# Altium schematic sheet CW342_XADC.SchDoc: <Enter Sheet Title>
size Letter; Organization: NewAE Technology Inc.; Address1: 1083 Queen St., Suite 196; Address2: Halifax; Address3: NS; Address4: Canada B3H 0B2; SheetNumber: 2; SheetTotal: 9; SheetApproved: NO
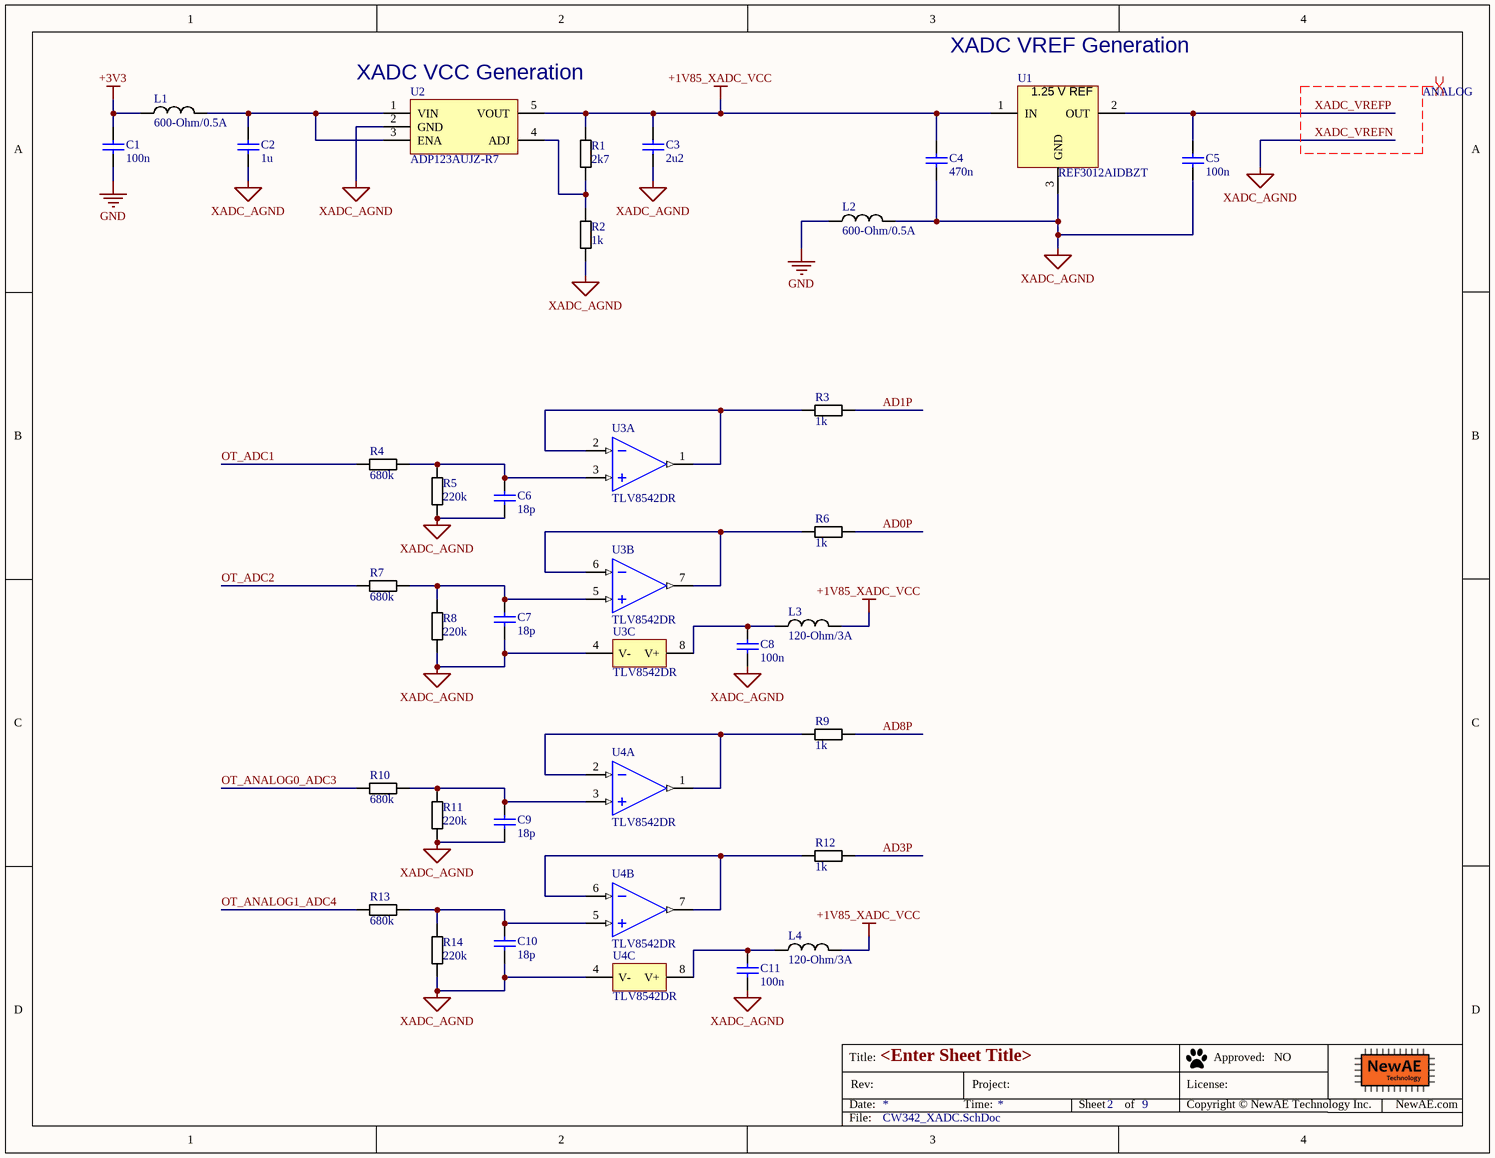
[diagram p0: CW342_XADC.SchDoc]

## Parts
C1  100n  [CAPC0402_M]
C2  1u  [CAPC0603_M]
C3  2u2  [CAPC0603_M]
C4  470n  [CAPC0603_M]
C5  100n  [CAPC0402_M]
C6  18p  [CAPC0402_M]
C7  18p  [CAPC0402_M]
C8  100n  [CAPC0402_M]
C9  18p  [CAPC0402_M]
C10  18p  [CAPC0402_M]
C11  100n  [CAPC0402_M]
L1  600-Ohm/0.5A  [IND_0603]
L2  600-Ohm/0.5A  [IND_0603]
L3  120-Ohm/3A  [IND_0603]
L4  120-Ohm/3A  [IND_0603]
R1  2k7  [RESC1005X40N]
R2  1k  [RESC1005X40N]
R3  1k  [RESC1005X40N]
R4  680k  [RESC1005X40N]
R5  220k  [RESC1005X40N]
R6  1k  [RESC1005X40N]
R7  680k  [RESC1005X40N]
R8  220k  [RESC1005X40N]
R9  1k  [RESC1005X40N]
R10  680k  [RESC1005X40N]
R11  220k  [RESC1005X40N]
R12  1k  [RESC1005X40N]
R13  680k  [RESC1005X40N]
R14  220k  [RESC1005X40N]
U1  REF3012AIDBZT  [SOT95P237X112-3N]
U2  Linear Voltage Regulator IC  1 Output  300mA TSOT-5  [SOT23-5P95_285X145L45X40]  (value not drawn)
U3  TLV8542DR  [SOIC127P600X175-8N]  (parts A,B,C of 3)
U4  TLV8542DR  [SOIC127P600X175-8N]  (parts A,B,C of 3)

## Nets
+1V85_XADC_VCC: C3.1 C4.1 L3.2 L4.2 R1.1 U1.1(IN) U2.5(VOUT)
+3V3: C1.1 L1.1
GND: C1.2 L2.1
XADC_VREFN: C2.2 C3.2 C4.2 C5.2 C6.2 C7.2 C8.2 C9.2 C10.2 C11.2 L2.2 R2.2 R5.2 R8.2 R11.2 R14.2 U1.3(GND) U2.2(GND) U3.4(V-) U4.4(V-)  [also labelled XADC_AGND]
AD0P: R6.2
AD1P: R3.2
AD3P: R12.2
AD8P: R9.2
OT_ADC1: R4.1
OT_ADC2: R7.1
OT_ANALOG0_ADC3: R10.1
OT_ANALOG1_ADC4: R13.1
XADC_VREFP: C5.1 U1.2(OUT)
NetC2_1: C2.1 L1.2 U2.1(VIN) U2.3(ENA)
NetC6_1: C6.1 R4.2 R5.1 U3.3(1_IN+)
NetC7_1: C7.1 R7.2 R8.1 U3.5(2_IN+)
NetC8_1: C8.1 L3.1 U3.8(V+)
NetC9_1: C9.1 R10.2 R11.1 U4.3(1_IN+)
NetC10_1: C10.1 R13.2 R14.1 U4.5(2_IN+)
NetC11_1: C11.1 L4.1 U4.8(V+)
NetR1_2: R1.2 R2.1 U2.4(ADJ)
NetR3_1: R3.1 U3.1(1_Out) U3.2(1_IN-)
NetR6_1: R6.1 U3.6(2_IN-) U3.7(2_Out)
NetR9_1: R9.1 U4.1(1_Out) U4.2(1_IN-)
NetR12_1: R12.1 U4.6(2_IN-) U4.7(2_Out)

## Layout directives
differential pair; differential pair class ANALOG: XADC_VREFN, XADC_VREFP

## Notes on the sheet
- (near U2) XADC VCC Generation
- XADC VREF Generation
- Title:
- Date:
- Rev:
- Time:
- Project:
- Sheet
- of
- License:
- Copyright © NewAE Technology Inc.
- Approved:
- NewAE.com
- File:
- (in symbol REF3012AIDBZT) 1.25 V REF

## Library data of the parts
C1 C5 C8 C11 = CCHIP-100n-0402: 100n, 0402; Manufacture Part Number 1: CGA2B3X7R1V104K050BB; Component Group: Capacitor; Case-EIA: 0402; Part Number: CCHIP-100n-0402; Footprint: 0402; Pin Count: 2; Value: 100n; Mounting Technology: SMT; Component Kind: Standard; Component Type: Standard; Supplier 1: Digi-Key; Supplier Part Number 1: 445-6901-1-ND
C2 = CCHIP-1u-0603: 1u, 0603, 50V; Manufacture Part Number 1: CL10A105KB8NNNC; Component Group: Capacitor; Case-EIA: 0603; Case-Metric: 1608; Rated Voltage: 50VDC; Part Number: CCHIP-1u-0603; Footprint: 0603; Pin Count: 2; Supplier 1: Digi-Key; Supplier Part Number 1: 1276-1860-1-ND; Value: 1u; Mounting Technology: SMT; Component Kind: Standard; Component Type: Standard
C3 = CCHIP-2u2-0603-25V: 2u2, 0603; Manufacture 1: Murata Electronics North America; Manufacture Part Number 1: GRM188R61E225MA12D; Component Group: Capacitor; Case-EIA: 0603; Case-Metric: 1608; Rated Voltage: 25VDC; Tolerance: ±20%; Part Number: CCHIP-2u2-0603-25V; Footprint: 0603; Pin Count: 2; Supplier 1: Digi-Key; Supplier Part Number 1: 490-12738-1-ND; Value: 2u2; Mounting Technology: SMT; RoHS: Yes; Component Kind: Standard; Component Type: Standard
C4 = CCHIP-470n-0603-50V: 470n, 0603, 50V; Manufacture 1: Taiyo Yuden; Manufacture Part Number 1: UMK107B7474KA-TR; Component Group: Capacitor; Case-EIA: 0603; Rated Voltage: 50VDC; Part Number: CCHIP-470n-0603-50V; Footprint: 0603; Pin Count: 2; Supplier 1: Digi-Key; Supplier Part Number 1: 587-3170-1-ND; Value: 470n; Mounting Technology: SMT; RoHS: Yes; Temperature Range: -55C to 125C; Component Kind: Standard; Component Type: Standard
C6 C7 C9 C10 = CCHIP-18p-0402: 18p, 0402; Manufacture Part Number 1: GRM1555C1H180JA01D; Component Group: Capacitor; Case-EIA: 0402; Part Number: CCHIP-18p-0402; Footprint: 0402; Pin Count: 2; Supplier 1: Digi-Key; Supplier Part Number 1: 490-5858-1-ND; Value: 18p; Mounting Technology: SMT; Component Kind: Standard; Component Type: Standard
L1 L2 = FBCHIP-600R-0603: 600 Ohm @ 100 MHz, 0.5A rated FB; Manufacture 1: Murata Electronics; Manufacture Part Number 1: BLM18AG601SN1D; Component Group: Inductor; Value: 600R/0.5A; Case-EIA: 0603; Case-Metric: 1608; PP Material Stack: 0; Part Number: FBCHIP-600R-0603; Footprint: 0603; Pin Count: 2; Supplier 1: Digi-Key; Supplier Part Number 1: 490-1014-2-ND; Rated Power: 0.5A; Component Kind: Standard; Component Type: Standard; PP Rotation: 0
L3 L4 = FBCHIP-120R-0603: 120 Ohm @ 100 MHz, 3A rated FB; Manufacture 1: Murata Electronics; Manufacture Part Number 1: BLM18SG121TN1D; Component Group: Inductor; Value: 120R/3A; Case-EIA: 0603; Case-Metric: 1680; PP Material Stack: 0; Part Number: FBCHIP-120R-0603; Footprint: 0603; Pin Count: 2; Supplier 1: Digi-Key; Supplier Part Number 1: 490-3996-1-ND; Rated Power: 3A; Component Kind: Standard; Component Type: Standard; PP Rotation: 0
R1 = RCHIP-2K7-0402: 2k7 res, 0402, 1%, 1/16W; Manufacture 1: Yageo; Manufacture Part Number 1: RC0402FR-072K7L; Component Group: Resistor; Case-EIA: 0402; Case-Metric: 1005; Rated Power: 0.063W; Rated Voltage: 75VDC; Part Number: RCHIP-2K7-0402; Footprint: 0402; Pin Count: 2; Supplier 1: Digi-Key; Supplier Part Number 1: 311-2.70KLRCT-ND; Value: 2k7; Tolerance: 1%; Mounting Technology: SMT; Temperature Range: -55C to 155C; Component Kind: Standard; Component Type: Standard
R2 R3 R6 R9 R12 = RCHIP-1K-0402: 1k res, 0402, 1%, 1/16W; Manufacture 1: Yageo; Manufacture Part Number 1: RC0402FR-071KL; Component Group: Resistor; Case-EIA: 0402; Case-Metric: 1005; Rated Power: 0.063W; Rated Voltage: 75VDC; Part Number: RCHIP-1K-0402; Footprint: 0402; Pin Count: 2; Supplier 1: Digi-Key; Supplier Part Number 1: 311-1.00KLRCT-ND; Value: 1k; Tolerance: 1%; Mounting Technology: SMT; Temperature Range: -55C to 155C; Component Kind: Standard; Component Type: Standard
R4 R7 R10 R13 = RCHIP-680K-0402: 680k res, 0402, 1%, 1/16W; Manufacture 1: Yageo; Manufacture Part Number 1: RC0402FR-07680KL; Component Group: Resistor; Case-EIA: 0402; Case-Metric: 1005; Rated Power: 0.063W; Rated Voltage: 75VDC; Part Number: RCHIP-680K-0402; Footprint: 0402; Pin Count: 2; Supplier 1: Digi-Key; Supplier Part Number 1: YAG3211CT-ND; Value: 680k; Tolerance: 1%; Mounting Technology: SMT; Temperature Range: -55C to 155C; Component Kind: Standard; Component Type: Standard
R5 R8 R11 R14 = RCHIP-220K-0402: 220k res, 0402, 1%, 1/16W; Manufacture 1: Yageo; Manufacture Part Number 1: RC0402FR-07220KL; Component Group: Resistor; Case-EIA: 0402; Case-Metric: 1005; Rated Power: 0.063W; Rated Voltage: 75VDC; Part Number: RCHIP-220K-0402; Footprint: 0402; Pin Count: 2; Supplier 1: Digi-Key; Supplier Part Number 1: 311-220KLRCT-ND; Value: 220k; Tolerance: 1%; Mounting Technology: SMT; Temperature Range: -55C to 155C; Component Kind: Standard; Component Type: Standard
U1 = REF3012AIDBZT: IC VREF SERIES 0.2% SOT23-3; Manufacture 1: Texas Instruments; Output Voltage: 1.25V; Max Input Voltage: 5.5V; Max Output Current: 25mA; Min Input Voltage: 1.8V; Nominal Supply Current: 42uA; Temperature Coefficient: 50ppm/°C; Number of Channels: 1; Quiescent Current: 50uA; Min Output Voltage: 1.248V; Reference Type: Series,Fixed; Component Group: Analog IC; PP Material Stack: 0; Supplier 1: Digi-Key; RoHS: Yes; Category: Voltage References; Stock 1: 7831; Pricing 1: 1=1.18000, 10=1.05300, 25=0.99960, 100=0.76760 (USD); Case/Package: SOT-23; Number of Pins: 3; Min Operating Temperature: -40°C; Max Operating Temperature: 125°C; Packaging: Tape and Reel; Package Quantity: 1; Output Current: 25mA; Max Supply Current: 50uA; Max Output Voltage: 1.25V; Reference Voltage: 1.25V; Termination: SMD/SMT; Length: 2.92mm; Width: 1.3mm; Height: 1mm; Radiation Hardening: No; REACH SVHC: No SVHC; Lead Free: Lead Free; ComponentLink3URL: https://datasheet.ciiva.com/2007/ref3012-2007154.pdf?src-supplier=Digi-Key; ComponentLink3Description: https://datasheet.ciiva.com/2007/ref3012-2007154.pdf?src-supplier=Digi-Key; ComponentLink4URL: https://datasheet.ciiva.com/2007/ref3012-2007155.pdf?src-supplier=Digi-Key; ComponentLink4Description: https://datasheet.ciiva.com/2007/ref3012-2007155.pdf?src-supplier=Digi-Key; ComponentLink5URL: https://datasheet.ciiva.com/3235/ref3033-3235533.pdf?src-supplier=Avnet; ComponentLink5Description: https://datasheet.ciiva.com/3235/ref3033-3235533.pdf?src-supplier=Avnet; ComponentLink6URL: https://datasheet.ciiva.com/3235/ref3033-3235534.pdf?src-supplier=Avnet; ComponentLink6Description: https://datasheet.ciiva.com/3235/ref3033-3235534.pdf?src-supplier=Avnet; .Checked SCH: *; .Checked PCB: *; Supplier Part Number 1: REF3012AIDBZTTR-ND; Manufacturer Part Number: REF3012AIDBZT; Part Number: REF3012AIDBZT; Footprint: SOT23-3; Manufacture Part Number 1: REF3012AIDBZT; Pin Count: 3; Mounting Technology: SMT; Component Kind: Standard; Component Type: Standard; PP Rotation: 0
U2 = ADP123AUJZ-R7: IC REG LIN POS ADJ 300MA TSOT5; Manufacture 1: Analog Devices Inc.; Dropout Voltage: 85mV; Output Voltage: 5V; Number of Outputs: 1; Max Input Voltage: 5.5V; Min Input Voltage: 2.3V; Min Current Limit: 350mA; Polarity: Positive; Quiescent Current: 45uA; Reference Voltage: 500mV; Min Output Voltage: 800mV; Accuracy: 1%; Power Supply Rejection Ratio (PSRR): 60dB; Max Supply Current: 170uA; Output Type: Adjustable; Component Group: Analog IC; PP Material Stack: 0; Supplier 1: Digi-Key; Category: Voltage Regulators - Linear; Stock 1: 14167; Pricing 1: 1=1.16000, 10=1.03300, 25=0.98000, 100=0.75250, 250=0.66500, 500=0.63000, 1000=0.49000 (USD); Case/Package: TSOT; Number of Pins: 5; Contact Plating: Tin,Matte; Min Operating Temperature: -40°C; Max Operating Temperature: 125°C; Output Current: 300mA; Max Output Current: 300mA; Packaging: Tape and Reel; Number of Regulators: 1; Max Output Voltage: 5V; Output Voltage Accuracy: 1%; Nominal Supply Current: 45uA; Operating Supply Current: 45uA; Length: 2.9mm; Width: 1.6mm; Height: 0.9mm; REACH SVHC: No SVHC; Lead Free: Contains Lead; ComponentLink3URL: https://datasheet.ciiva.com/2040/adp122-123-2040698.pdf?src-supplier=Digi-Key; ComponentLink3Description: https://datasheet.ciiva.com/2040/adp122-123-2040698.pdf?src-supplier=Digi-Key; ComponentLink4URL: https://datasheet.ciiva.com/2040/adp122-123-2040699.pdf?src-supplier=Digi-Key; ComponentLink4Description: https://datasheet.ciiva.com/2040/adp122-123-2040699.pdf?src-supplier=Digi-Key; Supplier Part Number 1: ADP123AUJZ-R7TR-ND; .Checked SCH: *; .Checked PCB: *; Manufacturer Part Number: ADP123AUJZ-R7; Part Number: ADP123AUJZ-R7; Manufacture Part Number 1: ADP123AUJZ-R7; Pin Count: 5; Mounting Technology: SMT; Component Kind: Standard; Component Type: Standard; PP Rotation: 0; Footprint: SOT23-5
U3 U4 = LM2904_SOIC8: IC OP-AMP GP; Manufacture 1: Texas Instruments; Component Group: Analog IC; PP Material Stack: 0; Part Number: LM2904_SOIC8; Footprint: SOIC8; Manufacture Part Number 1: TLV8542DR; Pin Count: 8; Supplier 1: Digi-Key; Supplier Part Number 1: 296-48991-1-ND; Mounting Technology: SMT; RoHS: Yes; Component Kind: Standard; Component Type: Standard; PP Rotation: 0